# Altium project Layer 2 LW SEN.PrjPcb
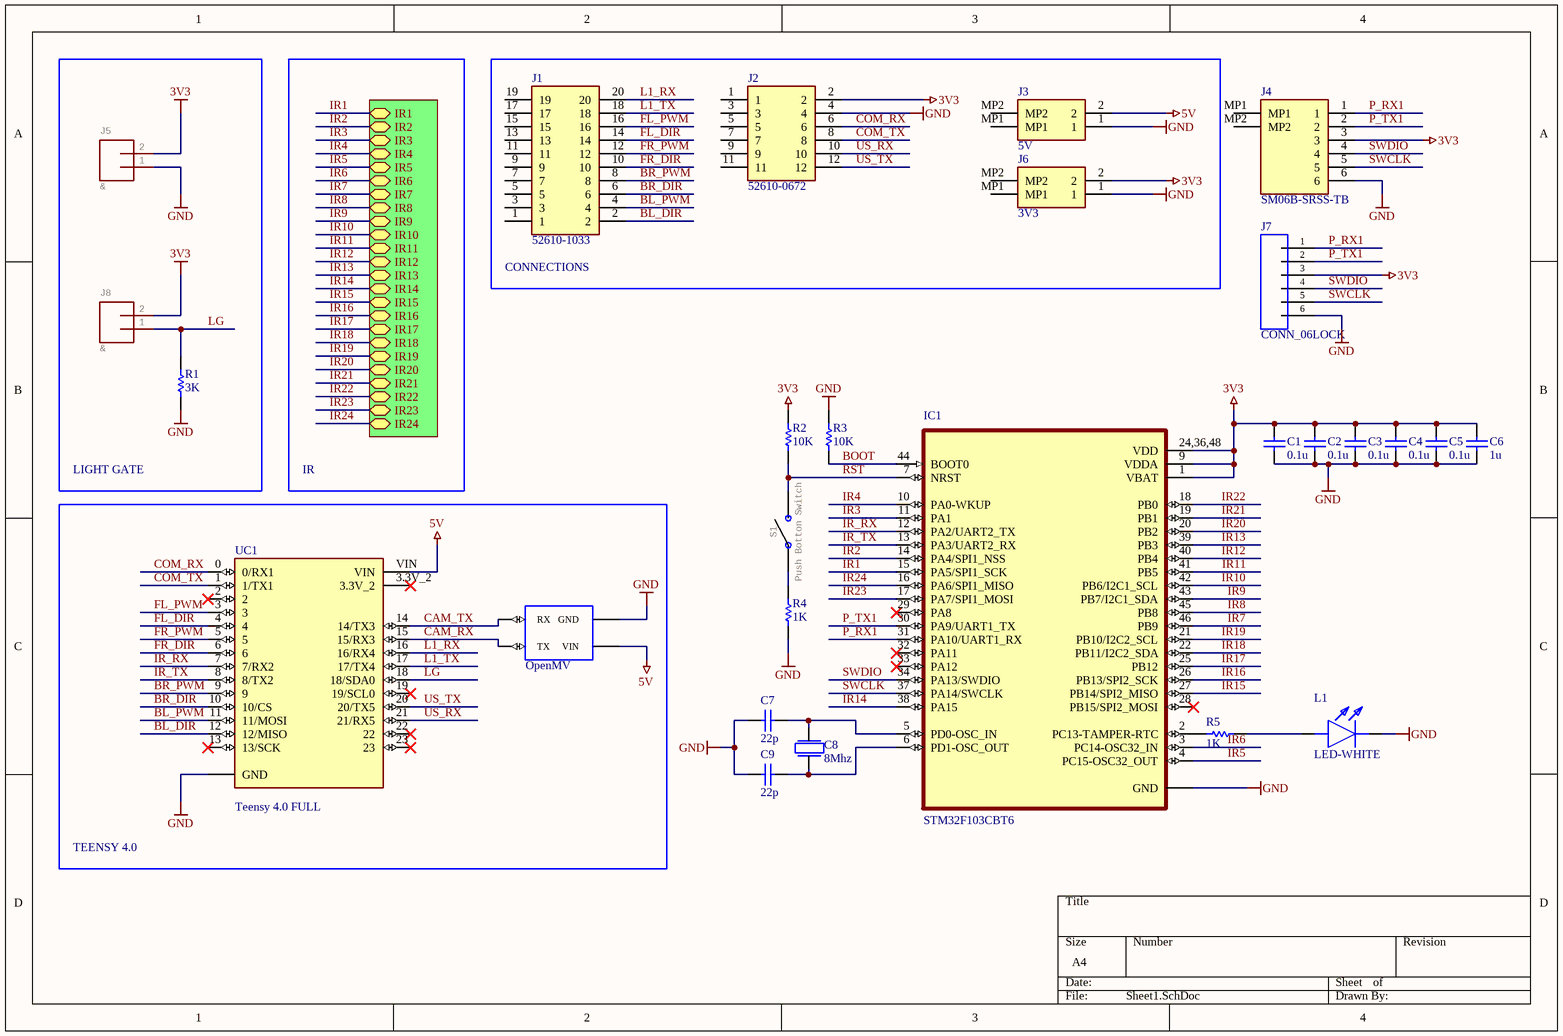
[diagram p0: Sheet1.SchDoc]
2 sheets, 75 parts. Net scope: hierarchical (ports join the sheet entries above them; power ports are global).
Board file: Sheet1.PcbDoc
Sheets:
  Sheet1.SchDoc
    U_ir = ir.SchDoc

## Sheet Sheet1.SchDoc
size A4; SheetNumber: 1; SheetTotal: 2

### Parts
C1  0.1u  [CAP0603]
C2  0.1u  [CAP0603]
C3  0.1u  [CAP0603]
C4  0.1u  [CAP0603]
C5  0.1u  [CAP0603]
C6  1u  [CAP0603]
C7  22p  [CAP0603]
C8  8Mhz  [CRYSTAL-8MHZ]
C9  22p  [CAP0603]
CAM1  OpenMV  [OPENMV3]
IC1  STM32F103CBT6  [QFP50P900X900X160-48N]
J1  52610-1033  [526101033]
J2  52610-0672  [526100672]
J3  5V  [BM02BSRSSTBLFSN]
J4  SM06B-SRSS-TB  [SM06BSRSSTB]
J5  &  [1X02_LOCK]
J6  3V3  [BM02BSRSSTBLFSN]
J7  CONN_06LOCK  [1X06_LOCK]
J8  &  [1X02_LOCK]
L1  LED-WHITE  [LED0603]
R1  3K  [RES0603]
R2  10K  [RES0603]
R3  10K  [RES0603]
R4  1K  [RES0603]
R5  1K  [RES0603]
S1  Push Botton Switch  [MOMENTARY_SWITCH_4X3]
UC1  Teensy 4.0 FULL  [MODULE_DEV-15583]

### Blocks framed on the sheet
LIGHT GATE: J5 J8 R1
CONNECTIONS: J1-J3 J6
TEENSY 4.0: CAM1 UC1

### Sub-sheets
U_ir = ir.SchDoc: IR1 (bidir), IR2 (bidir), IR3 (bidir), IR4 (bidir), IR5 (bidir), IR6 (bidir), IR7 (bidir), IR8 (bidir), IR9 (bidir), IR10 (bidir), IR11 (bidir), IR12 (bidir), IR13 (bidir), IR14 (bidir), IR15 (bidir), IR16 (bidir), IR17 (bidir), IR18 (bidir), IR19 (bidir), IR20 (bidir), IR21 (bidir), IR22 (bidir), IR23 (bidir), IR24 (bidir)

### Nets
3V3: C1.2 C2.2 C3.2 C4.2 C5.2 C6.2 IC1.1(VBAT) IC1.9(VDDA) IC1.24,36,48(VDD) J2.2 J4.3 J5.2 J6.2 J7.3 J8.2 R2.2
5V: CAM1.27(VIN) J3.2 UC1.VIN
GND: C1.1 C2.1 C3.1 C4.1 C5.1 C6.1 C7.2 C9.2 CAM1.28(GND) IC1.8,23,35,47(GND) J2.4 J3.1 J4.6 J5.1 J6.1 J7.6 L1.1(K) R1.1 R3.2 R4.1 UC1.GND
BL_DIR: J1.2 UC1.12(12/MISO)
BL_PWM: J1.4 UC1.11(11/MOSI)
BOOT: IC1.44(BOOT0) R3.1
BR_DIR: J1.6 UC1.10(10/CS)
BR_PWM: J1.8 UC1.9
CAM_RX: CAM1.15(TX) UC1.15(15/RX3)
CAM_TX: CAM1.16(RX) UC1.14(14/TX3)
COM_RX: J2.6 UC1.0(0/RX1)
COM_TX: J2.8 UC1.1(1/TX1)
FL_DIR: J1.14 UC1.4
FL_PWM: J1.16 UC1.3
FR_DIR: J1.10 UC1.6
FR_PWM: J1.12 UC1.5
IR1: IC1.15(PA5/SPI1_SCK) ; sheet U_ir/IR1
IR2: IC1.14(PA4/SPI1_NSS) ; sheet U_ir/IR2
IR3: IC1.11(PA1) ; sheet U_ir/IR3
IR4: IC1.10(PA0-WKUP) ; sheet U_ir/IR4
IR5: IC1.4(PC15-OSC32_OUT) ; sheet U_ir/IR5
IR6: IC1.3(PC14-OSC32_IN) ; sheet U_ir/IR6
IR7: IC1.46(PB9) ; sheet U_ir/IR7
IR8: IC1.45(PB8) ; sheet U_ir/IR8
IR9: IC1.43(PB7/I2C1_SDA) ; sheet U_ir/IR9
IR10: IC1.42(PB6/I2C1_SCL) ; sheet U_ir/IR10
IR11: IC1.41(PB5) ; sheet U_ir/IR11
IR12: IC1.40(PB4) ; sheet U_ir/IR12
IR13: IC1.39(PB3) ; sheet U_ir/IR13
IR14: IC1.38(PA15) ; sheet U_ir/IR14
IR15: IC1.27(PB14/SPI2_MISO) ; sheet U_ir/IR15
IR16: IC1.26(PB13/SPI2_SCK) ; sheet U_ir/IR16
IR17: IC1.25(PB12) ; sheet U_ir/IR17
IR18: IC1.22(PB11/I2C2_SDA) ; sheet U_ir/IR18
IR19: IC1.21(PB10/I2C2_SCL) ; sheet U_ir/IR19
IR20: IC1.20(PB2) ; sheet U_ir/IR20
IR21: IC1.19(PB1) ; sheet U_ir/IR21
IR22: IC1.18(PB0) ; sheet U_ir/IR22
IR23: IC1.17(PA7/SPI1_MOSI) ; sheet U_ir/IR23
IR24: IC1.16(PA6/SPI1_MISO) ; sheet U_ir/IR24
IR_RX: IC1.12(PA2/UART2_TX) UC1.7(7/RX2)
IR_TX: IC1.13(PA3/UART2_RX) UC1.8(8/TX2)
L1_RX: J1.20 UC1.16(16/RX4)
L1_TX: J1.18 UC1.17(17/TX4)
LG: J8.1 R1.2 UC1.18(18/SDA0)
P_RX1: IC1.31(PA10/UART1_RX) J4.1 J7.1
P_TX1: IC1.30(PA9/UART1_TX) J4.2 J7.2
RST: IC1.7(NRST) R2.1 S1.2
SWCLK: IC1.37(PA14/SWCLK) J4.5 J7.5
SWDIO: IC1.34(PA13/SWDIO) J4.4 J7.4
US_RX: J2.10 UC1.21(21/RX5)
US_TX: J2.12 UC1.20(20/TX5)
NetC7_1: C7.1 C8.2 IC1.5(PD0-OSC_IN)
NetC8_1: C8.1 C9.1 IC1.6(PD1-OSC_OUT)
NetIC1_2: IC1.2(PC13-TAMPER-RTC) R5.2
NetL1_2: L1.2(A) R5.1
NetR4_2: R4.2 S1.1

Not connected (* = marked no-connect by the designer): IC1 28(PB15/SPI2_MOSI)* 29(PA8)* 32(PA11)* 33(PA12)*; J1 1 3 5 7 9 11 13 15 17 19; J2 1 3 5 7 9 11; J3 MP1 MP2; J4 MP1 MP2; J6 MP1 MP2; UC1 2* 3.3V_2* 13(13/SCK)* 19(19/SCL0)* 22* 23*

### Notes on the sheet
- IR

### Library data of the parts
C1-C7 C9 = CAP0603: 0603 Capacitor
C8 = Crystal: 8/16Mhz
IC1 = STM32F103CBT6: ARMÂ® CortexÂ®-M3 STM32F1 Microcontroller IC 32-Bit 72MHz 128KB _128K x 8_ FLASH; Manufacturer_Name: STMicroelectronics; Datasheet Link: http://www.st.com/st-web-ui/static/active/en/resource/technical/document/datasheet/CD00161566.pdf; Height: 1.6mm; Manufacturer_Part_Number: STM32F103CBT6; Mouser Part Number: 511-STM32F103CBT6; Mouser Price/Stock: https://www.mouser.co.uk/ProductDetail/STMicroelectronics/STM32F103CBT6?qs=WxFF5lh7QM3goh6GV5Ogig%3D%3D; Arrow Part Number: STM32F103CBT6; Arrow Price/Stock: https://www.arrow.com/en/products/stm32f103cbt6/stmicroelectronics?region=europe
J1 = 52610-1033: Connector; Manufacturer_Name: Molex; Datasheet Link: https://www.mouser.com/datasheet/2/276/0526101033_FFC_FPC_CONNECTORS-294979.pdf; Height: 7.45mm; Manufacturer_Part_Number: 52610-1033; Mouser Part Number: 538-52610-1033; Mouser Price/Stock: https://www.mouser.co.uk/ProductDetail/Molex/52610-1033?qs=rw2VfpiI%2FsPpjB%252BOP20huA%3D%3D
J2 = 52610-0672: Connector; Manufacturer_Name: Molex; Datasheet Link: https://datasheet.datasheetarchive.com/originals/distributors/Datasheets_SAMA/e589a8f4ef95d6a702b751f11f707664.pdf; Height: 7.25mm; Manufacturer_Part_Number: 52610-0672; Mouser Part Number: 538-52610-0672; Mouser Price/Stock: https://www.mouser.co.uk/ProductDetail/Molex/52610-0672?qs=EtU2D%2FqTXbO6V1br%252BUkztQ%3D%3D
J3 J6 = BM02B-SRSS-TB_LF__SN_: Connector; Manufacturer_Name: JST (JAPAN SOLDERLESS TERMINALS); Manufacturer_Part_Number: BM02B-SRSS-TB(LF)(SN); Datasheet Link: http://www.jst-mfg.com/product/pdf/eng/eSR.pdf; Height: 4.25mm; Arrow Part Number: BM02B-SRSS-TB(LF)(SN); Arrow Price/Stock: https://www.arrow.com/en/products/bm02b-srss-tb-lf-sn/jst-manufacturing?region=europe
J4 = SM06B-SRSS-TB: Connector; Manufacturer_Name: JST (JAPAN SOLDERLESS TERMINALS); Datasheet Link: https://media.digikey.com/pdf/Data%20Sheets/JST%20PDFs/SR%20Connector.pdf; Height: 2.95mm; Manufacturer_Part_Number: SM06B-SRSS-TB
J5 J8 = CONN_02LOCK: GateName_1: G$1; DeviceName: LOCK; LibraryName: SparkFun-Connectors; Source: SparkFun-Connectors.SCHLIB; Pin Count: 2; Component Type: Standard; Design Item ID: CONN_02LOCK; DeviceSetName: CONN_02; SymbolName_1: CONN_02; Package: 1X02_LOCK
L1 = LED-0603
R1-R5 = RES0603: Resistor
UC1 = Teensy 4.0: RT1062 Teensy 4.0 i.MX ARMÂ® CortexÂ®-M7 MPU Embedded Evaluation Board; MP: DEV-15583; MF: SparkFun Electronics; Component Type: Standard; Digi-Key_Part_Number: 1568-DEV-15583-ND; Source: SnapEDAsch.SchLib; Pin Count: 33; Design Item ID: DEV-15583; Package: None; SnapEDA_Link: https://www.snapeda.com/parts/DEV-15583/SparkFun%20Electronics/view-part/4001229/?ref=snap; Digi-Key_Purchase_URL: https://www.digikey.com/product-detail/en/sparkfun-electronics/DEV-15583/1568-DEV-15583-ND/10384551?utm_source=snapeda&utm_medium=aggregator&utm_campaign=symbol; Value: *

## Sheet ir.SchDoc
size A4; SheetNumber: 2; SheetTotal: 2
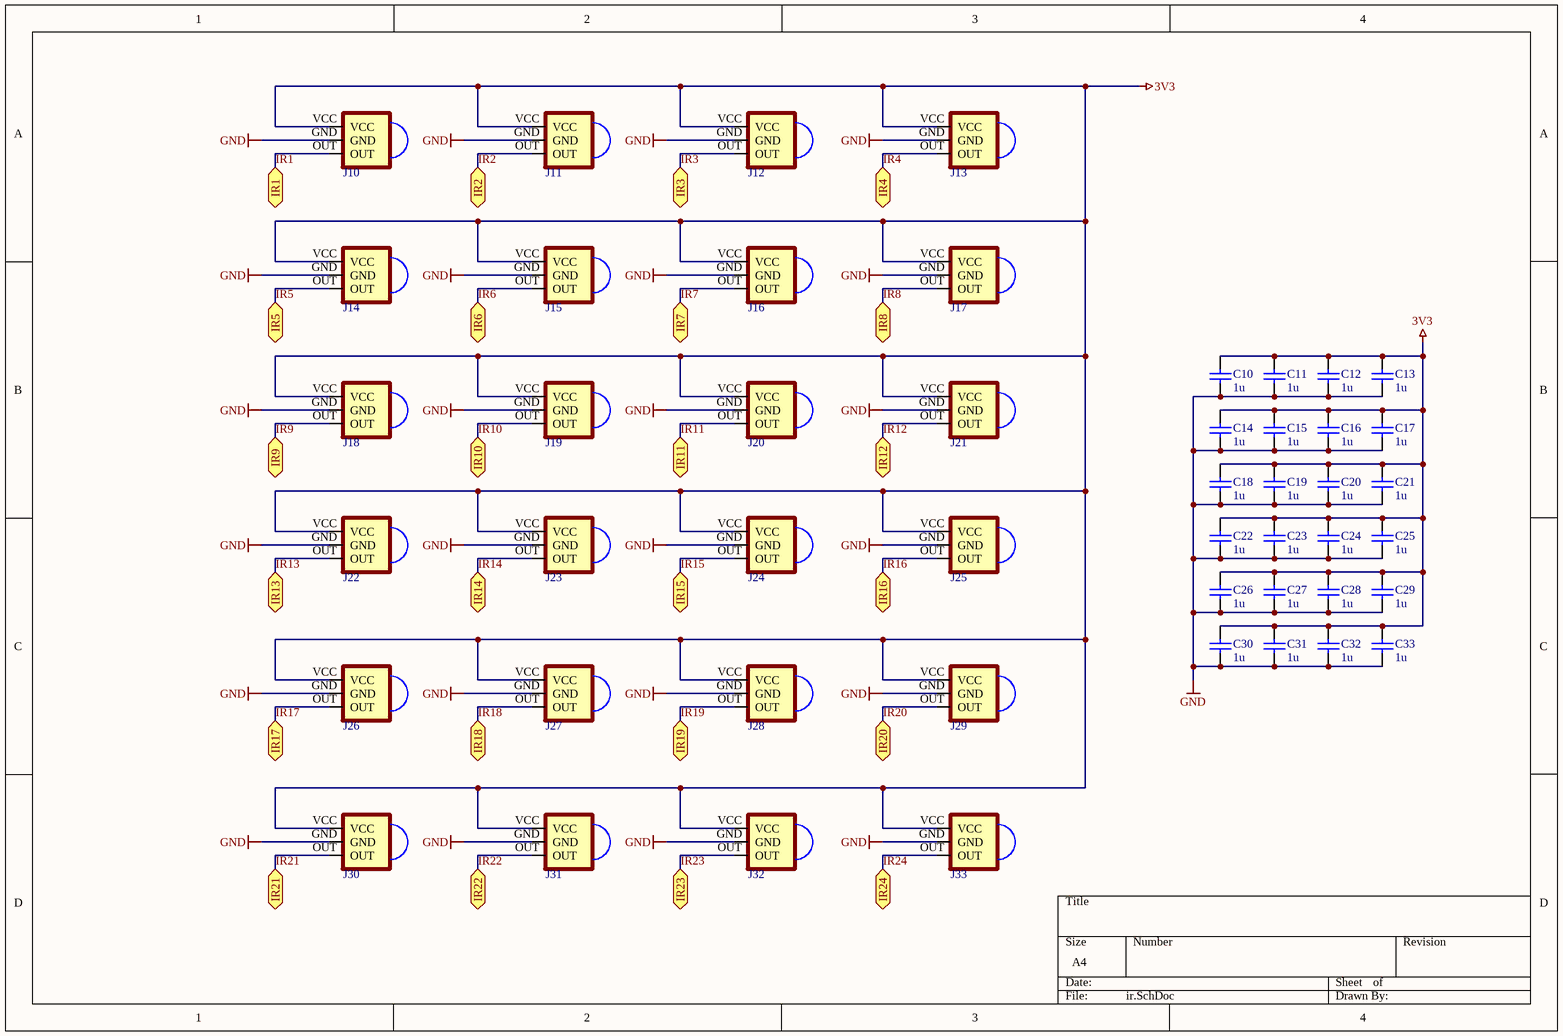
[diagram p1: ir.SchDoc]

### Parts
C10  1u  [CAP0603]
C11  1u  [CAP0603]
C12  1u  [CAP0603]
C13  1u  [CAP0603]
C14  1u  [CAP0603]
C15  1u  [CAP0603]
C16  1u  [CAP0603]
C17  1u  [CAP0603]
C18  1u  [CAP0603]
C19  1u  [CAP0603]
C20  1u  [CAP0603]
C21  1u  [CAP0603]
C22  1u  [CAP0603]
C23  1u  [CAP0603]
C24  1u  [CAP0603]
C25  1u  [CAP0603]
C26  1u  [CAP0603]
C27  1u  [CAP0603]
C28  1u  [CAP0603]
C29  1u  [CAP0603]
C30  1u  [CAP0603]
C31  1u  [CAP0603]
C32  1u  [CAP0603]
C33  1u  [CAP0603]
J10  TSSP58038  [TSSP58038]  (value not drawn)
J11  TSSP58038  [TSSP58038]  (value not drawn)
J12  TSSP58038  [TSSP58038]  (value not drawn)
J13  TSSP58038  [TSSP58038]  (value not drawn)
J14  TSSP58038  [TSSP58038]  (value not drawn)
J15  TSSP58038  [TSSP58038]  (value not drawn)
J16  TSSP58038  [TSSP58038]  (value not drawn)
J17  TSSP58038  [TSSP58038]  (value not drawn)
J18  TSSP58038  [TSSP58038]  (value not drawn)
J19  TSSP58038  [TSSP58038]  (value not drawn)
J20  TSSP58038  [TSSP58038]  (value not drawn)
J21  TSSP58038  [TSSP58038]  (value not drawn)
J22  TSSP58038  [TSSP58038]  (value not drawn)
J23  TSSP58038  [TSSP58038]  (value not drawn)
J24  TSSP58038  [TSSP58038]  (value not drawn)
J25  TSSP58038  [TSSP58038]  (value not drawn)
J26  TSSP58038  [TSSP58038]  (value not drawn)
J27  TSSP58038  [TSSP58038]  (value not drawn)
J28  TSSP58038  [TSSP58038]  (value not drawn)
J29  TSSP58038  [TSSP58038]  (value not drawn)
J30  TSSP58038  [TSSP58038]  (value not drawn)
J31  TSSP58038  [TSSP58038]  (value not drawn)
J32  TSSP58038  [TSSP58038]  (value not drawn)
J33  TSSP58038  [TSSP58038]  (value not drawn)

### Ports
IR1 (bidir), IR2 (bidir), IR3 (bidir), IR4 (bidir), IR5 (bidir), IR6 (bidir), IR7 (bidir), IR8 (bidir), IR9 (bidir), IR10 (bidir), IR11 (bidir), IR12 (bidir), IR13 (bidir), IR14 (bidir), IR15 (bidir), IR16 (bidir), IR17 (bidir), IR18 (bidir), IR19 (bidir), IR20 (bidir), IR21 (bidir), IR22 (bidir), IR23 (bidir), IR24 (bidir)

### Nets
3V3: C10.2 C11.2 C12.2 C13.2 C14.2 C15.2 C16.2 C17.2 C18.2 C19.2 C20.2 C21.2 C22.2 C23.2 C24.2 C25.2 C26.2 C27.2 C28.2 C29.2 C30.2 C31.2 C32.2 C33.2 J10.VCC J11.VCC J12.VCC J13.VCC J14.VCC J15.VCC J16.VCC J17.VCC J18.VCC J19.VCC J20.VCC J21.VCC J22.VCC J23.VCC J24.VCC J25.VCC J26.VCC J27.VCC J28.VCC J29.VCC J30.VCC J31.VCC J32.VCC J33.VCC
GND: C10.1 C11.1 C12.1 C13.1 C14.1 C15.1 C16.1 C17.1 C18.1 C19.1 C20.1 C21.1 C22.1 C23.1 C24.1 C25.1 C26.1 C27.1 C28.1 C29.1 C30.1 C31.1 C32.1 C33.1 J10.GND J11.GND J12.GND J13.GND J14.GND J15.GND J16.GND J17.GND J18.GND J19.GND J20.GND J21.GND J22.GND J23.GND J24.GND J25.GND J26.GND J27.GND J28.GND J29.GND J30.GND J31.GND J32.GND J33.GND
IR1: J10.OUT ; port IR1
IR2: J11.OUT ; port IR2
IR3: J12.OUT ; port IR3
IR4: J13.OUT ; port IR4
IR5: J14.OUT ; port IR5
IR6: J15.OUT ; port IR6
IR7: J16.OUT ; port IR7
IR8: J17.OUT ; port IR8
IR9: J18.OUT ; port IR9
IR10: J19.OUT ; port IR10
IR11: J20.OUT ; port IR11
IR12: J21.OUT ; port IR12
IR13: J22.OUT ; port IR13
IR14: J23.OUT ; port IR14
IR15: J24.OUT ; port IR15
IR16: J25.OUT ; port IR16
IR17: J26.OUT ; port IR17
IR18: J27.OUT ; port IR18
IR19: J28.OUT ; port IR19
IR20: J29.OUT ; port IR20
IR21: J30.OUT ; port IR21
IR22: J31.OUT ; port IR22
IR23: J32.OUT ; port IR23
IR24: J33.OUT ; port IR24

### Library data of the parts
C10-C33 = CAP0603: 0603 Capacitor
J10-J33 = CMP-073-000000-6: 38 kHz 25 m 45° 5.5 V Through Hole IR Receiver Module for Light Barrier Systems; MF: Vishay; Package: TSSP; Design Item ID: TSSP58038; Value: *; MP: TSSP58038; Component Type: Standard; Pin Count: 3

## Nets that join several sheets
3V3: Sheet1 (16 pins), ir (48 pins)
GND: Sheet1 (21 pins), ir (48 pins)
IR1: Sheet1 (IC1.15), ir (J10.OUT)
IR2: Sheet1 (IC1.14), ir (J11.OUT)
IR3: Sheet1 (IC1.11), ir (J12.OUT)
IR4: Sheet1 (IC1.10), ir (J13.OUT)
IR5: Sheet1 (IC1.4), ir (J14.OUT)
IR6: Sheet1 (IC1.3), ir (J15.OUT)
IR7: Sheet1 (IC1.46), ir (J16.OUT)
IR8: Sheet1 (IC1.45), ir (J17.OUT)
IR9: Sheet1 (IC1.43), ir (J18.OUT)
IR10: Sheet1 (IC1.42), ir (J19.OUT)
IR11: Sheet1 (IC1.41), ir (J20.OUT)
IR12: Sheet1 (IC1.40), ir (J21.OUT)
IR13: Sheet1 (IC1.39), ir (J22.OUT)
IR14: Sheet1 (IC1.38), ir (J23.OUT)
IR15: Sheet1 (IC1.27), ir (J24.OUT)
IR16: Sheet1 (IC1.26), ir (J25.OUT)
IR17: Sheet1 (IC1.25), ir (J26.OUT)
IR18: Sheet1 (IC1.22), ir (J27.OUT)
IR19: Sheet1 (IC1.21), ir (J28.OUT)
IR20: Sheet1 (IC1.20), ir (J29.OUT)
IR21: Sheet1 (IC1.19), ir (J30.OUT)
IR22: Sheet1 (IC1.18), ir (J31.OUT)
IR23: Sheet1 (IC1.17), ir (J32.OUT)
IR24: Sheet1 (IC1.16), ir (J33.OUT)